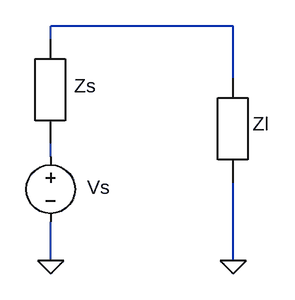
[diagram p0: schematic Draft4.asc]
Draft4.asc, the LTspice schematic file:
Version 4
SHEET 1 880 680
WIRE 192 -32 -32 -32
WIRE -32 -16 -32 -32
WIRE 192 32 192 -32
WIRE -32 128 -32 112
WIRE -32 256 -32 208
WIRE 192 256 192 160
FLAG -32 256 0
FLAG 192 256 0
SYMBOL voltage -32 112 R0
WINDOW 0 45 54 Left 2
SYMATTR InstName Vs
SYMATTR Value ""
SYMBOL Block -32 48 R0
WINDOW 0 29 -7 Left 2
SYMATTR InstName Zs
SYMBOL Block 192 96 R0
WINDOW 0 24 -8 Left 2
SYMATTR InstName Zl

The netlist it stands for:
* Draft4.asc
Vs N002 0
Zs N001 N002
Zl N001 0
.backanno
.end